# EAGLE design Simblee(I2C_V1) (EAGLE 6.5.0)
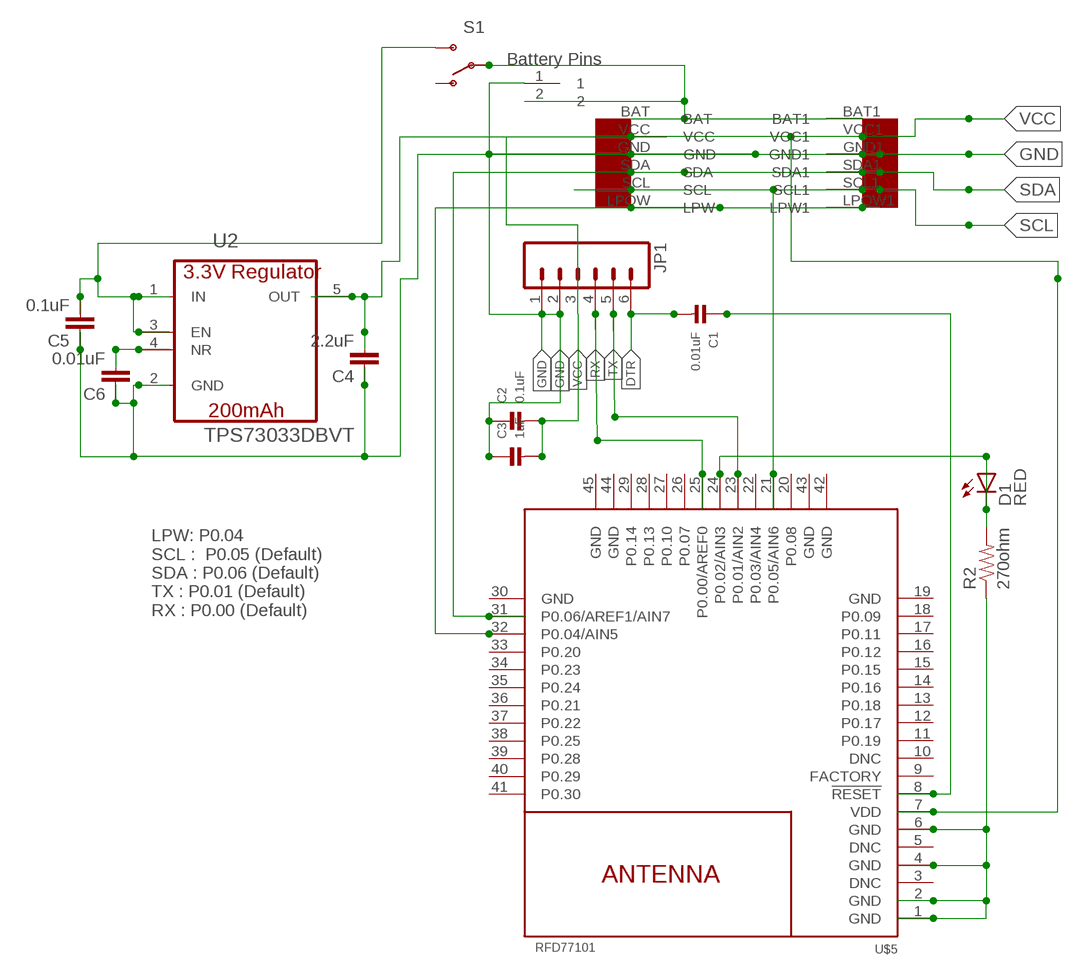
[diagram p0: schematic, sheet 1]

## Parts
BATTERYPINS  MINI_BATTERY_HOLES  [MINI_BATTERY_HOLES]
C1  0.01uF  CAP_CERAMIC0402  [0402]
C2  0.1uF  CAP_CERAMIC0402  [0402]
C3  1uF  CAP_CERAMIC0402  [0402]
C4  2.2uF  CAP0402-CAP  [0402-CAP]
C5  0.1uF  CAP0402-CAP  [0402-CAP]
C6  0.01uF  CAP0402-CAP  [0402-CAP]
D1  RED  LED-RED0603  [LED-0603]
JP1  M06SIP  [1X06]
R2  270ohm  RESISTOR0402-RES  [0402-RES]
S1  SWITCH-SPDT-SMD-A  [SWITCH-SPST-SMD-A]
U2  TPS73033DBVT  [SOT95P290X145-5N]
U$1  EZ-I2CHEADERV1  [EZ-I2CHEADERV1]
U$5  RFD77101  [RFD77101]

## Nets
BAT: BATTERYPINS.2 S1.2(P) U$1.BAT U$1.BAT1
BAT_INPUT: C5.2 S1.3(S) U2.1(IN) U2.3(EN)
DTR: C1.2 JP1.6
GND: BATTERYPINS.1 C2.1 C3.1 C4.1 C5.1 C6.1 JP1.1 JP1.2 R2.1 U2.2(GND) U$1.GND U$1.GND1 U$5.1(GND) U$5.2(GND) U$5.4(GND) U$5.6(GND)
LPW: U$1.LPOW1(LPW1) U$1.LPOW(LPW) U$5.32(P0.04/AIN5)
N$1: C1.1 U$5.8(!RESET!)
N$2: D1.A U$5.24(P0.02/AIN3)
N$7: C6.2 U2.4(NR)
N$19: D1.C R2.2
RX: JP1.4 U$5.25(P0.00/AREF0)
SCL: U$1.SCL U$1.SCL1 U$5.21(P0.05/AIN6)
SDA: U$1.SDA U$1.SDA1 U$5.31(P0.06/AREF1/AIN7)
TX: JP1.5 U$5.23(P0.01/AIN2)
VCC: C2.2 C3.2 C4.2 JP1.3 U2.5(OUT) U$1.VCC U$1.VCC1 U$5.7(VDD)
Unconnected: S1.1(O) U$5.3(DNC) U$5.5(DNC) U$5.9(FACTORY) U$5.10(DNC) U$5.11(P0.19) U$5.12(P0.17) U$5.13(P0.18) U$5.14(P0.16) U$5.15(P0.15) U$5.16(P0.12) U$5.17(P0.11) U$5.18(P0.09) U$5.20(P0.08) U$5.22(P0.03/AIN4) U$5.26(P0.07) U$5.27(P0.10) U$5.28(P0.13) U$5.29(P0.14) U$5.33(P0.20) U$5.34(P0.23) U$5.35(P0.24) U$5.36(P0.21) U$5.37(P0.22) U$5.38(P0.25) U$5.39(P0.28) U$5.40(P0.29) U$5.41(P0.30)

## Notes on the sheet
- Battery Pins
- LPW: P0.04
  SCL :  P0.05 (Default)
  SDA : P0.06 (Default)
  TX : P0.01 (Default)
  RX : P0.00 (Default)

## Power pins joined to a net without a drawn wire
GND: U$5.19(GND) U$5.30(GND) U$5.42(GND) U$5.43(GND) U$5.44(GND) U$5.45(GND)

## Library data of the parts
BATTERYPINS = UniqueInteractionsLib:MINI_BATTERY_HOLES
C1-C3 = microbuilder:CAP_CERAMIC: Ceramic Capacitors 0402 - 0402 Surface Mount Capacitors 16pF 50V 5% [Digikey: 445-4899-2-ND] 18pF 50V 5% [Digikey: 490-1281-2-ND] 22pF 50V 5% [Digikey: 490-1283-2-ND] 68pF 50V 5% [Digikey: 490-1289-2-ND] 0.1uF 10V 10% [Digikey: 490-1318-2-ND] 1.0uF 6.3V 10% [Digikey: 490-1320-2-ND] 0603 - 0603 Surface Mount Capacitors 16 pF 50V 5% [Digikey: 445-5051-2-ND] 22 pF 50V [Digikey: PCC220ACVTR-ND] 33 pF 50V 5% [Digikey: 490-1415-1-ND] 56pF 50V 5% [Digikey: 490-1421-1-ND] 220pF 50V 5% [Digikey: 445-1285-1-ND] 680 pF 50V 2200 pF 50V 5% C0G [Digikey: 445-1297-1-ND] 5600 pF 100V 5% X7R [Digikey: 478-3711-1-ND] 0.1 µF 25V 10% [Digikey: PCC2277TR-ND] 0.22 µF 16V 10% X7R [Digikey: 445-1318-1-ND] 1.0 µF 25V 10% [Digikey: 445-5146-2-ND] 0603 - RF Specific 3pF 250V +/-0.1pF RF [Digikey: 712-1347-1-ND] 18 pF 250V 5% [Digikey: 478-3505-1-ND or 712-1322-1-ND] 56 pF 250V 5% C0G RF [Digikey: 490-4867-1-ND] 68 pF 250V RF [Digikey: 490-4868-1-ND] 0805 - 0805 Surface Mount Capacitors 220 pF 250V 2% RF Ceramic Capacitor [Digikey: 712-1398-1-ND] 1000 pF 50V 2% NP0 Ceramic Capacitor [Digikey: 478-3760-1-ND] 0.1 µF 25V 10% Ceramic Capacitor [Digikey: PCC1828TR-ND] 1.0 µF 16V 10% Ceramic Capacitor[Digikey: 490-1691-2-ND] 10.0 µF 10V 10% Ceramic Capacitor[Digikey: 709-1228-1-ND] 10.0 uF 16V 10% Ceramic Capacitor [Digikey: 478-5165-2-ND] 47 uF 6.3V 20% Ceramic Capacitor [Digikey: 587-1779-1-ND or 399-5506-1-ND] 1206 - 1206 Surface Mount Capacitors 47uF 10V 20% Ceramic Capacitor [Digikey: 490-5528-1-ND or 399-5508-1-ND or 445-6010-1-ND] 100uF 6.3V -20%, +80% Y5V Ceramic Capacitor (Digikey: 490-4512-1-ND, Mouser: 81-GRM31CF50J107ZE1L)
C4-C6 = SparkFun:CAP: Capacitor Standard 0603 ceramic capacitor, and 0.1" leaded capacitor.
D1 = SparkFun-LED:LED-RED: Assorted Red LEDs LilyPad 1206- DIO-09912 1206- DIO-00809 0603- DIO-00819; PROD_ID: DIO-00819
JP1 = SparkFun-Connectors:M06: Header 6 Standard 6-pin 0.1" header. Use with straight break away headers (SKU : PRT-00116), right angle break away headers (PRT-00553), swiss pins (PRT-00743), machine pins (PRT-00117), and female headers (PRT-00115). Molex polarized connector foot print use with SKU : PRT-08094 with associated crimp pins and housings. NOTES ON THE VARIANTS LOCK and LOCK_LONGPADS... This footprint was designed to help hold the alignment of a through-hole component (i.e. 6-pin header) while soldering it into place. You may notice that each hole has been shifted either up or down by 0.005 of an inch from it's more standard position (which is a perfectly straight line). This slight alteration caused the pins (the squares in the middle) to touch the edges of the holes. Because they are alternating, it causes a "brace" to hold the component in place. 0.005 has proven to be the perfect amount of "off-center" position when using our standard breakaway headers. Although looks a little odd when you look at the bare footprint, once you have a header in there, the alteration is very hard to notice. Also,if you push a header all the way into place, it is covered up entirely on the bottom side. This idea of altering the position of holes to aid alignment will be further integrated into the Sparkfun Library for other footprints. It can help hold any component with 3 or more connection pins.
R2 = SparkFun-Passives:RESISTOR: Resistor Basic schematic elements and footprints for 0603, 1206, and PTH resistors.
S1 = SparkFun-Electromechanical:SWITCH-SPDT: SPDT Switch Simple slide switch, Spark Fun Electronics SKU : COM-00102 DPDT SMT slide switch, AYZ0202, SWCH-08179
U2 = UniqueInteractionsLib:TPS73033DBVT: V REG LDO 0.2A +3.3V, SOT-23-5; MPN: TPS73033DBVT; OC_FARNELL: 1135395; OC_NEWARK: 71J8233; PACKAGE: SOT-23-5; SUPPLIER: TEXAS INSTRUMENTS
U$1 = UniqueInteractionsLib:EZ-I2CHEADERV1
U$5 = RFDigital:RFD77101: Simblee ™ BLE Module RFD77101 © 2015 RF Digital Corporation www.RFDigital.com www.Simblee.com PATENTS PENDING 04.01.2015

## Board
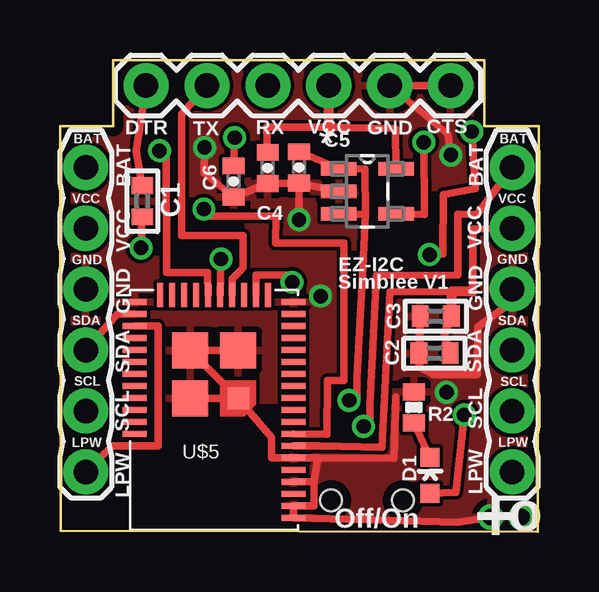
[diagram p1: board, top side]
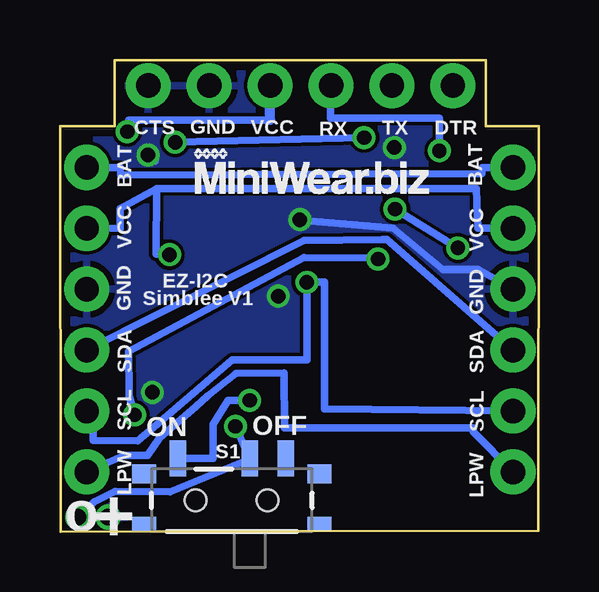
[diagram p2: board, bottom side, seen from below]

Size 19.97 x 19.68 mm. Coordinates in mm from the lower left corner, seen from the top.
Outline: 0.03,0.04 19.93,0 19.97,16.92 17.7,16.91 17.7,19.67 2.25,19.66 2.21,19.68 2.21,16.91 0,16.92 0.03,0.04
Copper layers (1*16): Top 0.0356mm / dielectric 1.5011mm / Bottom 0.0356mm
Design rules "oshParkPCBDesignRules": minimum track width 6mil, minimum drill 13mil, track to track 6mil, track to pad 6mil, pad to pad 6mil, via to via 6mil, smd to smd 6mil, copper to edge 15mil, drill to drill 6mil, minimum pad ring 7mil, minimum via ring 7mil, stop-mask expansion 3mil, vias tented up to drill 0mil, thermal gap 10mil

### Footprints (pad centres in the part's own frame; a part is rotated, then mirrored left to right if it is on the bottom)
MINI_BATTERY_HOLES = drill 0.7 pad 1.016: 1 0.435,3.175; 2 0.435,1.905
0402 = smd 0.7 x 0.9: 1 -0.65,0; 2 0.65,0
0402-CAP = smd 0.7 x 0.9: 1 -0.65,0; 2 0.65,0
LED-0603 = smd 0.8 x 0.8: A 0,-0.75; C 0,0.75
1X06 = drill 1.016 pad 1.88: 1 0,0; 2 2.54,0; 3 5.08,0; 4 7.62,0; 5 10.16,0; 6 12.7,0
0402-RES = smd 0.7 x 0.9: 1 -0.65,0; 2 0.65,0
SWITCH-SPST-SMD-A = smd 0.7 x 1.5: 1 -2.25,-1.75; 2 -0.75,-1.75; 3 2.25,-1.75 | smd 1 x 0.6: GND1 -3.65,1; GND3 3.65,1 | smd 1 x 0.8: GND2 -3.65,-1.1; GND4 3.65,-1.1 | hole 0.9: -1.5,0; 1.5,0
SOT95P290X145-5N = smd 1.473 x 0.559: 1 -1.194,0.94; 2 -1.194,0; 3 -1.194,-0.94; 4 1.194,-0.94; 5 1.194,0.94
EZ-I2CHEADERV1 = drill 1.016 pad 1.88: BAT 0,-1.27; BAT1 17.78,-1.27; GND 0,-6.35; GND1 17.78,-6.35; LPOW 0,-13.97; LPOW1 17.78,-13.97; SCL 0,-11.43; SCL1 17.78,-11.43; SDA 0,-8.89; SDA1 17.78,-8.89; VCC 0,-3.81; VCC1 17.78,-3.81
RFD77101 = smd 1 x 0.254: 1 0,0; 2 0,-0.5; 3 0,-1; 4 0,-1.5; 5 0,-2; 6 0,-2.5; 7 0,-3; 8 0,-3.5; 9 0,-4; 10 0,-4.5; 11 0,-5; 12 0,-5.5; 13 0,-6; 14 0,-6.5; 15 0,-7; 16 0,-7.5; 17 0,-8; 18 0,-8.5; 19 0,-9; 30 6.61,-9; 31 6.61,-8.5; 32 6.61,-8; 33 6.61,-7.5; 34 6.61,-7; 35 6.61,-6.5; 36 6.61,-6; 37 6.61,-5.5; 38 6.61,-5; 39 6.61,-4.5; 40 6.61,-4; 41 6.61,-3.5 | smd 0.254 x 1: 20 1.055,-9.29; 21 1.555,-9.29; 22 2.055,-9.29; 23 2.555,-9.29; 24 3.055,-9.29; 25 3.555,-9.29; 26 4.055,-9.29; 27 4.555,-9.29; 28 5.055,-9.29; 29 5.555,-9.29 | smd 0.9 x 0.9: 42 2.3,-4.99 | smd 1.5 x 1.5: 43 2.3,-6.99; 44 4.3,-6.99; 45 4.3,-4.99

### Placement (x,y rotation side)
BATTERYPINS  21.14,0.18 90 top
C1  3.43,13.79 90 top
C2  15.62,7.45 0 top
C3  15.67,8.99 0 top
C4  8.66,15.18 90 top
C5  9.97,15.2 90 top
C6  7.24,14.61 90 top
D1  15.43,2.36 0 top
JP1  16.29,18.61 180 top
R2  14.76,5.19 270 top
S1  12.81,1.32 180 bottom
U2  12.82,14.2 0 top
U$1  1.08,16.47 0 top
U$3  [LOGO2]  14.46,13.91 0 bottom
U$5  9.73,0.58 180 top

### Tracks (layer width: path | path; a pad name or v marks a point on that pad's centre or on a via)
BAT  (via drill 0.6)
  Top 0.305: v12.66,4.4 12.92,4.4 12.92,5.33 13.2,10.69 16.59,10.72 16.59,13.25 17.39,13.24 U$1.BAT1
  Bottom 0.305: U$1.BAT 2.37,15.2 2.39,14.94 17.45,14.88 17.47,15.2 U$1.BAT1 | BATTERYPINS.2 19.18,0.61 18.55,1.26 17.68,1.7 15.39,1.67 12.08,3.02 S1.2 v12.66,4.4
BAT_INPUT  (via drill 0.6)
  Top 0.305: 12.73,13.26 12.71,15.12 U2.1 C5.2 | 12.73,13.26 11.63,13.24 U2.3 | 12.73,13.26 12.64,11.02 12.39,6.45 12.39,5.49 v12.06,5.48
  Bottom 0.305: v12.06,5.48 12.96,5.49 13.59,4.48 13.59,3.07 S1.3
DTR
  Top 0.305: JP1.6 3.17,15.88 C1.2
GND  (via drill 0.6)
  Top 0.305: JP1.1 JP1.2 16.17,16.59 v16.3,15.72 | U$1.GND1 18.86,9.61 17.42,8.55 17.41,6.56 15.56,6.56 15,6.85 14.98,7.01 C2.1 15.02,7.57 C3.1 | 10.77,3.09 U$5.6 8.83,3.08 8.83,3.95 U$5.42 | 10.77,3.09 10.59,2.1 | 10.59,2.1 U$5.4 | 10.59,2.1 10.6,1.08 U$5.2 U$5.1 16.58,0.39 BATTERYPINS.1 | 10.77,3.09 13.93,3.06 14.01,5.63 | U2.2 C5.1 | C5.1 C4.1 C6.1 6,14.97 v6.03,16.03 | U$5.42 U$5.45 | U$5.42 U$5.44 U$5.43 | v9.97,13.02 C5.1
  Bottom 0.305: v16.3,15.72 16,15.88 16,15.46 | U$1.GND 2.53,10.95 4,10.95 6.09,12.67 10.01,13 v9.97,13.02
  other vias: 10.87,9.83 16.12,5.82
  pour Top: -0.58,20.04 19.96,19.88 20.13,0.34 9.55,0.22 9.46,5.47 2.34,5.55 2.34,0.22 -0.63,0.23
  pour Bottom: -0.67,0.31 2.34,0.27 2.34,5.55 9.41,5.45 9.5,0.33 19.85,0.19 19.76,19.79 -0.53,19.95
LPW
  Top 0.305: U$5.32 4.09,8.58 4.09,3.59 2.2,3.59 U$1.LPOW
  Bottom 0.305: U$1.LPOW1 17.29,3.19 16.32,3.2 15.81,3.93 14.3,5.23 13.81,5.67 12.63,6.6 10.63,6.62 10.62,4.33 2.74,4.33 2.74,4.16 U$1.LPOW
N$1  (via drill 0.6)
  Top 0.305: U$5.8 11.14,4.06 11.16,6.31 11.84,6.31 11.84,6.71 11.85,12.04 8.99,12.05 9,13.16 6.28,13.16 v6,13.46 | v3.38,11.84 C1.1
  Bottom 0.305: v6,13.46 v3.38,11.84
N$2  (via drill 0.6)
  Top 0.305: U$5.24 v6.71,11.38 | D1.A 16.51,1.64 v16.86,4.88
  Bottom 0.305: v6.71,11.38 6.95,11.43 9.8,11.44 17.12,7.52 17.09,5.79 17.1,5.66 v16.86,4.88
N$7  (via drill 0.6)
  Top 0.305: C6.2 v7.29,16.44 | v15.17,16.25 15.19,13.23 U2.4
  Bottom 0.305: v7.29,16.44 v15.17,16.25
N$19
  Top 0.305: R2.2 D1.C
RX  (via drill 0.6)
  Top 0.305: U$5.25 6.17,10.81 4.44,10.81 4.43,15.88 v4.15,15.89
  Bottom 0.305: v4.15,15.89 4.16,17.25 8.69,17.25 8.69,18.61 JP1.4
SCL  (via drill 0.6)
  Top 0.305: v9.68,10.41 9.43,10.47 9.43,10.72 8.17,10.72 8.18,10.68 U$5.21
  Bottom 0.305: U$1.SCL1 18.59,5.01 18.59,3.81 16.73,3.8 16.06,4.35 12.79,7.18 9.68,7.18 v9.68,10.41 8.94,10.41 8.94,5.13 U$1.SCL
SDA
  Top 0.305: U$1.SDA 2.29,8.97 2.41,9.08 U$5.31
  Bottom 0.305: U$1.SDA1 9.79,12.14 6.53,12.2 6.33,12.2 U$1.SDA
TX
  Top 0.305: JP1.5 5.07,17.43 5.08,12.35 7.65,12.35 7.63,12.1 7.63,11.02 7.49,10.86 7.17,10.54 7.17,10.25 U$5.23
VCC  (via drill 0.6)
  Top 0.305: C4.2 8.62,16.88 11.2,16.87 13.99,16.81 U2.5 | U$1.VCC1 17.21,12.63 17.21,10.01 13.77,10 13.42,3.53 10.83,3.59 U$5.7 | v17.17,16.69 17.33,14.31 15.98,14.06 15.97,11.59 v15.41,11.56 | C3.2 16.03,8.23 C2.2
  Top 0.406: 17.21,10.01 16.32,10.01 C3.2 | 11.2,16.87 11.21,16.87 JP1.3
  Bottom 0.305: U$1.VCC 2.54,12.66 2.61,14.31 15.95,14.32 | 15.95,14.32 17.46,13.48 17.46,12.64 U$1.VCC1 | 11.21,17.18 17.12,17.16 17.12,16.69 v17.17,16.69 | v15.41,11.56 15.45,11.57 15.96,11.58 15.95,14.32
  Bottom 0.406: 11.21,17.18 JP1.3

### Text on the board
tNames: DTR | TX | RX | VCC | GND | CTS | EZ-I2C / Simblee V1 | + | o | Off/On
bNames: DTR | TX | RX | VCC | GND | CTS | EZ-I2C / Simblee V1 | OFF | ON | o | +